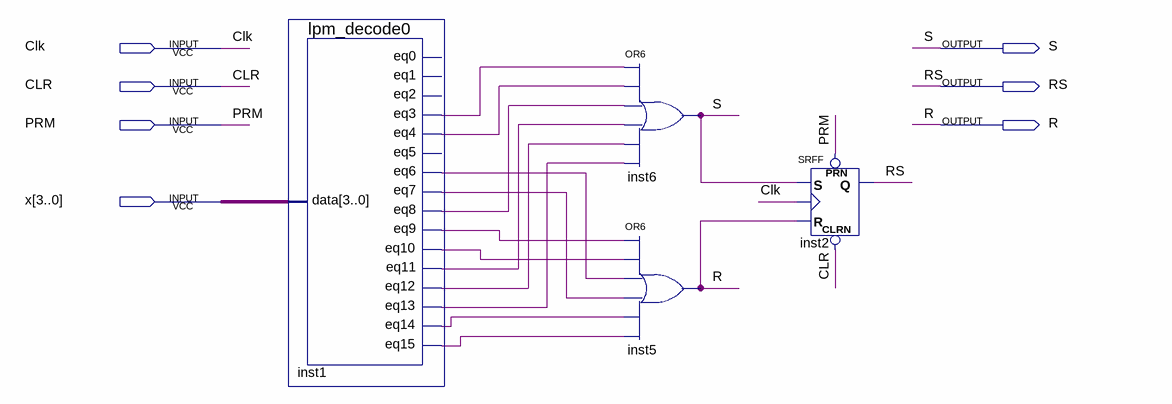
[diagram p0: schematic sheet]
// Quartus schematic RS_trigger.bdf as structural Verilog: 4 symbols, 7 pins
module RS_trigger (
  input  Clk,
  input  CLR,
  input  PRM,
  input  [3:0] x,
  output S,
  output RS,
  output R
);

  wire inst1_eq3, inst1_eq4, inst1_eq6, inst1_eq7, inst1_eq8, inst1_eq9, inst1_eq10, inst1_eq11, inst1_eq12,
       inst1_eq13, inst1_eq14, inst1_eq15;

  lpm_decode0 inst1 (
    .data(x), .eq3(inst1_eq3), .eq4(inst1_eq4), .eq6(inst1_eq6), .eq7(inst1_eq7), .eq8(inst1_eq8),
    .eq9(inst1_eq9), .eq10(inst1_eq10), .eq11(inst1_eq11), .eq12(inst1_eq12), .eq13(inst1_eq13),
    .eq14(inst1_eq14), .eq15(inst1_eq15));  // open: eq0, eq1, eq2, eq5
  or inst6 (S, inst1_eq3, inst1_eq4, inst1_eq8, inst1_eq11, inst1_eq12, inst1_eq13);
  or inst5 (R, inst1_eq9, inst1_eq10, inst1_eq6, inst1_eq7, inst1_eq14, inst1_eq15);
  SRFF inst2 (.PRN(PRM), .CLRN(CLR), .S(S), .R(R), .CLK(Clk), .Q(RS));
endmodule
